# Altium schematic sheet LAN.SchDoc
size A4
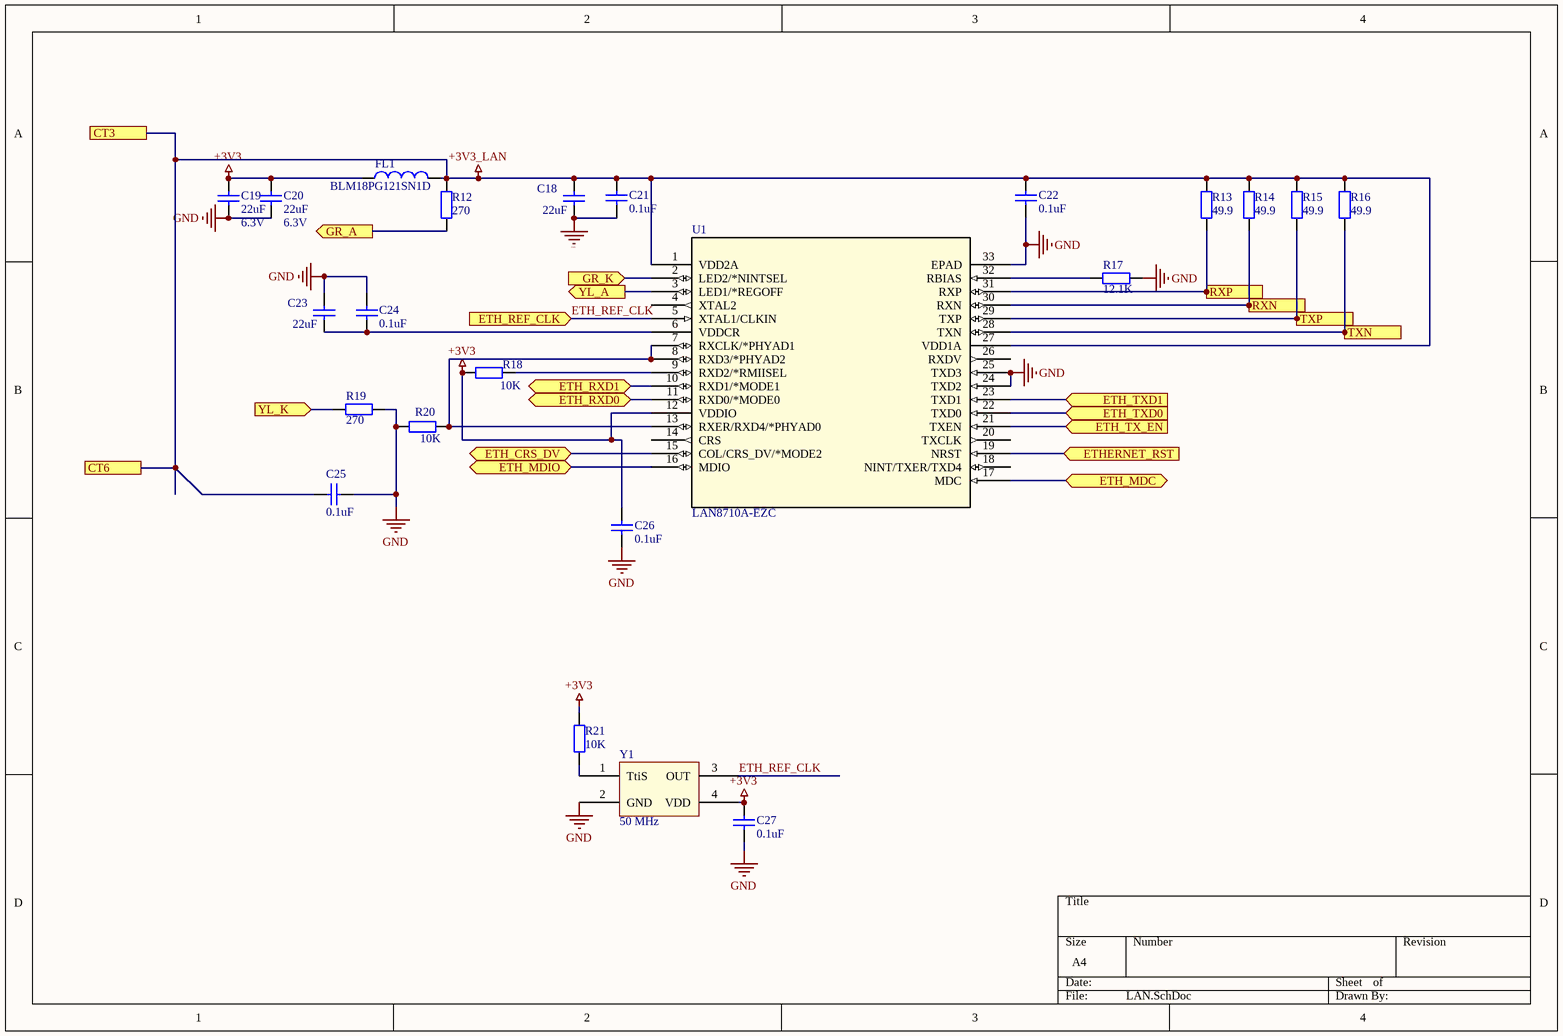
[diagram p0: LAN.SchDoc]

## Parts
C18  value 22uF  [C0805]  (hidden comment: C0805-22uF-10V-X5R)
C19  value 22uF  Voltage: 6.3V  [C0603]  (hidden comment: C0603-22uF-6.3V-X5R)
C20  value 22uF  Voltage: 6.3V  [C0603]  (hidden comment: C0603-22uF-6.3V-X5R)
C21  value 0.1uF  [C0603]  (hidden comment: C0603-0.1uF-50V-X7R)
C22  value 0.1uF  [C0603]  (hidden comment: C0603-0.1uF-50V-X7R)
C23  value 22uF  [C0805]  (hidden comment: C0805-22uF-10V-X5R)
C24  value 0.1uF  [C0603]  (hidden comment: C0603-0.1uF-50V-X7R)
C25  value 0.1uF  [C0603]  (hidden comment: C0603-0.1uF-50V-X7R)
C26  value 0.1uF  [C0603]  (hidden comment: C0603-0.1uF-50V-X7R)
C27  value 0.1uF  [C0603]  (hidden comment: C0603-0.1uF-50V-X7R)
FL1  BLM18PG121SN1D  [BLM18AG102BH1D]
R12  value 270  [R0603]  (hidden comment: R0603-270-1%)
R13  value 49.9  [R0603]  (hidden comment: R0603-49.9-1%)
R14  value 49.9  [R0603]  (hidden comment: R0603-49.9-1%)
R15  value 49.9  [R0603]  (hidden comment: R0603-49.9-1%)
R16  value 49.9  [R0603]  (hidden comment: R0603-49.9-1%)
R17  value 12.1K  [R0603]  (hidden comment: R0603-12.1K-1%)
R18  value 10K  [R0603]  (hidden comment: R0603-10K-1%)
R19  value 270  [R0603]  (hidden comment: R0603-270-1%)
R20  value 10K  [R0603]  (hidden comment: R0603-10K-1%)
R21  value 10K  [R0603]  (hidden comment: R0603-10K-1%)
U1  LAN8710A-EZC  [QFN32_5X5MC_MCH]
Y1  value 50 MHz  [D7SX]  (hidden comment: HXO-36B 50.000 HZ)

## Ports
CT3, CT6, ETH_CRS_DV (bidir), ETH_MDC (bidir), ETH_MDIO (bidir), ETH_REF_CLK (in), ETH_RXD0 (bidir), ETH_RXD1 (bidir), ETH_TX_EN (in), ETH_TXD0 (in), ETH_TXD1 (in), ETHERNET_RST (in), GR_A (out), GR_K (in), RXN (out), RXP (out), TXN (out), TXP (out), YL_A (out), YL_K (in)

## Nets
+3V3: C19.2 C20.2 C26.2 C27.2 FL1.1 R18.1 R21.2 U1.12(VDDIO) Y1.4(VDD)
+3V3_LAN: C18.2 C21.1 C22.1 C25.2 FL1.2 R12.2 R13.2 R14.2 R15.2 R16.2 U1.1(VDD2A) U1.27(VDD1A) ; port CT6, port CT3
GND: C18.1 C19.1 C20.1 C21.2 C22.2 C23.2 C24.2 C25.1 C26.1 C27.1 R17.2 R19.1 R20.1 U1.24(TXD2) U1.25(TXD3) U1.33(EPAD) Y1.2(GND)
ETH_CRS_DV: U1.15(COL/CRS_DV/*MODE2) ; port ETH_CRS_DV
ETH_MDC: U1.17(MDC) ; port ETH_MDC
ETH_MDIO: U1.16(MDIO) ; port ETH_MDIO
ETH_REF_CLK: U1.5(XTAL1/CLKIN) Y1.3(OUT) ; port ETH_REF_CLK
ETH_RXD0: U1.11(RXD0/*MODE0) ; port ETH_RXD0
ETH_RXD1: U1.10(RXD1/*MODE1) ; port ETH_RXD1
ETH_TX_EN: U1.21(TXEN) ; port ETH_TX_EN
ETH_TXD0: U1.22(TXD0) ; port ETH_TXD0
ETH_TXD1: U1.23(TXD1) ; port ETH_TXD1
ETHERNET_RST: U1.19(NRST) ; port ETHERNET_RST
GR_A: R12.1 ; port GR_A
GR_K: U1.2(LED2/*NINTSEL) ; port GR_K
RXN: R14.1 U1.30(RXN) ; port RXN
RXP: R13.1 U1.31(RXP) ; port RXP
TXN: R16.1 U1.28(TXN) ; port TXN
TXP: R15.1 U1.29(TXP) ; port TXP
YL_A: U1.3(LED1/*REGOFF) ; port YL_A
YL_K: R19.2 ; port YL_K
NetC23_1: C23.1 C24.1 U1.6(VDDCR)
NetR17_1: R17.1 U1.32(RBIAS)
NetR18_2: R18.2 U1.9(RXD2/*RMIISEL)
NetR20_2: R20.2 U1.7(RXCLK/*PHYAD1) U1.8(RXD3/*PHYAD2) U1.13(RXER/RXD4/*PHYAD0)
NetR21_1: R21.1 Y1.1(TtiS)

Not connected (* = marked no-connect by the designer): U1 4(XTAL2) 14(CRS) 18(NINT/TXER/TXD4) 20(TXCLK) 26(RXDV)

## Library data of the parts
C18 C23 = C0805-22uF-10V-X5R: Ceramic Capacitor; Supplier 1: Digi-Key; Supplier Part Number 1: 490-10511-1-ND
C19 C20 = C0603-22uF-6.3V-X5R: Ceramic Capacitor; Supplier 1: Digi-Key; Supplier Part Number 1: 445-8028-1-ND
C21 C22 C24-C27 = C0603-0.1uF-50V-X7R: Ceramic Capacitor; Supplier 1: Digi-Key; Supplier Part Number 1: 445-1324-1-ND
FL1 = BLM18PG121SN1D: Filter; Manufacturer_Name: Murata Electronics; Datasheet Link: https://www.murata.com/en-us/products/productdetail?partno=BLM18PG121SN1%23; Height: 0.95mm; Manufacturer_Part_Number: BLM18PG121SN1D; Arrow Part Number: BLM18PG121SN1D; Arrow Price/Stock: https://www.arrow.com/en/products/blm18pg121sn1d/murata-manufacturing; Mouser Part Number: 81-BLM18PG121SN1D; Mouser Price/Stock: https://www.mouser.co.uk/ProductDetail/Murata-Electronics/BLM18PG121SN1D?qs=tY8e8KZalarVxhnmnUYZ1A%3D%3D
R12 R19 = R0603-270-1%: Chip Resistor; Supplier 1: Digi-Key; Supplier Part Number 1: P300HCT-ND
R13-R16 = R0603-49.9-1%: Chip Resistor; Supplier 1: Digi-Key; Supplier Part Number 1: P49.9HTR-ND
R17 = R0603-12.1K-1%: Chip Resistor; Supplier 1: Digi-Key; Supplier Part Number 1: P12.1KHTR-ND
R18 R20 R21 = R0603-10K-1%: Chip Resistor; Supplier 1: Digi-Key; Supplier Part Number 1: P10.0KHCT-ND
U1 = LAN8710A-EZC: Small Footprint MII/RMII 10/100 Ethernet / Transceiver with HP Auto-MDIX and / flexPWR® Technology; Vendor: Microchip; Built_By: EMA_UL_Team; SourceLibrary: Microchip_2014-12-15; Manufacturer_Part_Number: LAN8710A-EZC; Copyright: Copyright (C) 2018 Accelerated Designs. All rights reserved; RefDes: RefDes; Type: DEV